# Altium schematic sheet USB_C_PD.SchDoc
size A4; ApprovedBy: Mateusz Kowalik; CheckedBy: Mateusz Kowalik; Author: Mateusz Kowalik; CompanyName: InMotion Labs sp. z o.o.; DrawnBy: Mateusz Kowalik; Engineer: Mateusz Kowalik; Organization: InMotion Labs sp. z o.o.; Address1: Rydlówka 5A; Address2: 30-363 Kraków; Address4: Poland; DocumentNumber: 17; Revision: Rev 0; SheetNumber: 17; SheetTotal: 17
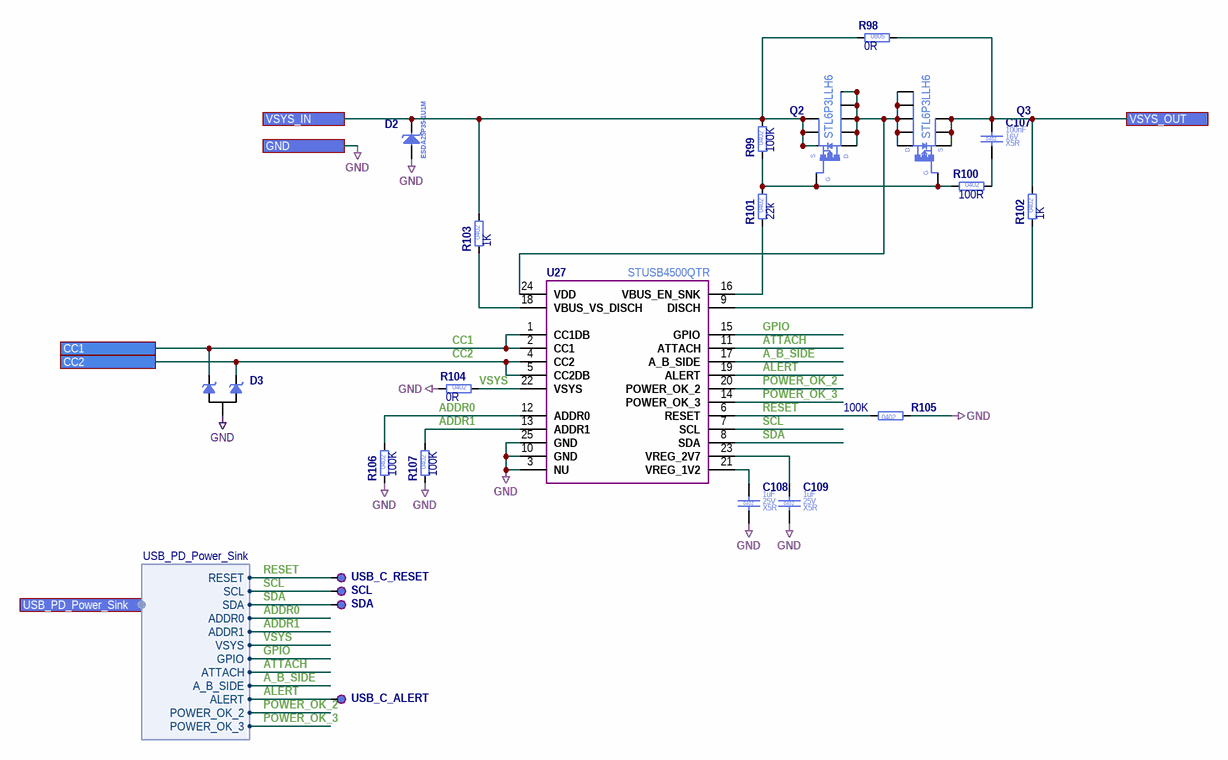
[diagram p0: USB_C_PD.SchDoc]

## Parts
C107  Case/Package: 0402  Voltage Rating (DC): 16V  Dielectric: X5R  Capacitance: 100nF  [C_0402_1005]  (hidden comment: C_100NF_16V_X5R_0402_10)
C108  Case/Package: 0402  Voltage Rating (DC): 25V  Dielectric: X5R  Capacitance: 1uF  [C_0402_1005]  (hidden comment: C_1UF_25V_X5R_0402_10)
C109  Case/Package: 0402  Voltage Rating (DC): 25V  Dielectric: X5R  Capacitance: 1uF  [C_0402_1005]  (hidden comment: C_1UF_25V_X5R_0402_10)
D2  ESDA25P35-1U1M  [TVS_0603_1610]
D3  ESDA25W  [SOT323_SC70]  (value not drawn)
Q2  STL6P3LLH6  [PQFN65P330X332X105_HS-9N]
Q3  STL6P3LLH6  [PQFN65P330X332X105_HS-9N]
R98  Resistance: 0R  Case/Package: 0805  [R_0805_2012]  (hidden comment: R_0R_0805_1)
R99  Resistance: 100K  Case/Package: 0402  [R_0402_1005]  (hidden comment: R_100K_0402_1)
R100  Resistance: 100R  Case/Package: 0402  [R_0402_1005]  (hidden comment: R_100R_0402_1)
R101  Resistance: 22k  Case/Package: 0402  [R_0402_1005]  (hidden comment: R_22K_0402_1)
R102  Resistance: 1K  Case/Package: 0402  [R_0402_1005]  (hidden comment: R_1K_0402_1)
R103  Resistance: 1K  Case/Package: 0402  [R_0402_1005]  (hidden comment: R_1K_0402_1)
R104  Resistance: 0R  Case/Package: 0402  [R_0402_1005]  (hidden comment: R_0R_0402_1)
R105  Resistance: 100K  Case/Package: 0402  [R_0402_1005]  (hidden comment: R_100K_0402_1)
R106  Resistance: 100K  Case/Package: 0402  [R_0402_1005]  (hidden comment: R_100K_0402_1)
R107  Resistance: 100K  Case/Package: 0402  [R_0402_1005]  (hidden comment: R_100K_0402_1)
SCL  TP_PAD_1.3MM  [TP_PAD_1.3MM]  (value not drawn)  (no BOM)
SDA  TP_PAD_1.3MM  [TP_PAD_1.3MM]  (value not drawn)  (no BOM)
U27  STUSB4500QTR  [QFN50P400X400X100_HS-25N]
USB_C_ALERT  TP_PAD_1.3MM  [TP_PAD_1.3MM]  (value not drawn)  (no BOM)
USB_C_RESET  TP_PAD_1.3MM  [TP_PAD_1.3MM]  (value not drawn)  (no BOM)

## Ports
CC1, CC2, GND, USB_PD_Power_Sink (harness USB_PD_Power_Sink), VSYS_IN, VSYS_OUT

## Harnesses
USB_PD_Power_Sink: RESET, SCL, SDA, ADDR0, ADDR1, VSYS, GPIO, ATTACH, A_B_SIDE, ALERT, POWER_OK_2, POWER_OK_3

## Nets
GND: C108.2 C109.2 D2.2(A) D3.3 R104.1 R105.1 R106.1 R107.1 U27.3(NU) U27.10(GND) U27.25(GND) ; port GND
A_B_SIDE: U27.17(A_B_SIDE) ; port USB_PD_Power_Sink.A_B_SIDE
ADDR0: R106.2 U27.12(ADDR0) ; port USB_PD_Power_Sink.ADDR0
ADDR1: R107.2 U27.13(ADDR1) ; port USB_PD_Power_Sink.ADDR1
ALERT: U27.19(ALERT) USB_C_ALERT.1(TP) ; port USB_PD_Power_Sink.ALERT
ATTACH: U27.11(ATTACH) ; port USB_PD_Power_Sink.ATTACH
CC1: D3.1 U27.1(CC1DB) U27.2(CC1) ; port CC1
CC2: D3.2 U27.4(CC2) U27.5(CC2DB) ; port CC2
GPIO: U27.15(GPIO) ; port USB_PD_Power_Sink.GPIO
POWER_OK_2: U27.20(POWER_OK_2) ; port USB_PD_Power_Sink.POWER_OK_2
POWER_OK_3: U27.14(POWER_OK_3) ; port USB_PD_Power_Sink.POWER_OK_3
RESET: R105.2 U27.6(RESET) USB_C_RESET.1(TP) ; port USB_PD_Power_Sink.RESET
SCL: SCL.1(TP) U27.7(SCL) ; port USB_PD_Power_Sink.SCL
SDA: SDA.1(TP) U27.8(SDA) ; port USB_PD_Power_Sink.SDA
VSYS: R104.2 U27.22(VSYS) ; port USB_PD_Power_Sink.VSYS
VSYS_IN: D2.1(C) Q2.1(S) Q2.2(S) Q2.3(S) R98.1 R99.2 R103.2 ; port VSYS_IN
VSYS_OUT: C107.1 Q3.1(S) Q3.2(S) Q3.3(S) R98.2 R102.2 ; port VSYS_OUT
NetC107_2: C107.2 R100.2
NetC108_1: C108.1 U27.21(VREG_1V2)
NetC109_1: C109.1 U27.23(VREG_2V7)
NetQ2_4: Q2.4(G) Q3.4(G) R99.1 R100.1 R101.2
NetQ2_5: Q2.5(D) Q2.6(D) Q2.7(D) Q2.8(D) Q2.9(D) Q3.5(D) Q3.6(D) Q3.7(D) Q3.8(D) Q3.9(D) U27.24(VDD)
NetR101_1: R101.1 U27.16(VBUS_EN_SNK)
NetR102_1: R102.1 U27.9(DISCH)
NetR103_1: R103.1 U27.18(VBUS_VS_DISCH)

## Notes on the sheet
- Title
- Size:
- Date:
- A4

## Library data of the parts
C107 = C_100NF_16V_X5R_0402_10: Ceramic Capacitor; Manufacturer Part Number: EMK105BJ104KV-F; Manufacturer: Taiyo Yuden; Value: 100nF; Tolerance: 10%; Part Number: C_100NF_16V_X5R_0402_10; Mount: Surface Mount; Height: 500um; HelpURL: http://datasheet.octopart.com/EMK105BJ104KV-F-Taiyo-Yuden-datasheet-8857305.pdf; RoHS: Compliant; Max Operating Temperature: 125°C; Status: MK; Supplier 1: Mouser; Supplier Part Number 1: 963-EMK105BJ104KV-F; Manufacturer 2: Samsung Electro-Mechanics; Manufacturer Part Number 2: CL05B104KO5NNNC; Supplier 2: LCSC; Supplier Part Number 2: C1525
C108 C109 = C_1UF_25V_X5R_0402_10: Ceramic Capacitor; Manufacturer Part Number: CL05A105KA5NQNC; Manufacturer: Samsung Electro-Mechanics; Value: 1uF; Tolerance: 10%; Part Number: C_1UF_25V_X5R_0402_10; Mount: Surface Mount; Height: 550um; HelpURL: https://pl.mouser.com/datasheet/2/585/MLCC-1837944.pdf; RoHS: Compliant; Max Operating Temperature: 85°C; Status: MK; Supplier 1: Mouser; Supplier Part Number 1: 187-CL05A105KA5NQNC; Manufacturer 2: Samsung Electro-Mechanics; Manufacturer Part Number 2: CL05A105KA5NQNC; Supplier 2: LCSC; Supplier Part Number 2: C52923
D2 = ESDA25P35-1U1M: High power transient voltage suppressor; Manufacturer: STMicroelectronics; Max Power Dissipation: 1400W; Direction: Unidirectional; Max Breakdown Voltage: 24.6; Working Voltage: 22V; Min Breakdown Voltage: 23.3V; Box: 391; Part Number: ESDA25P35-1U1M; Case/Package: 0603; Manufacturer Part Number: ESDA25P35-1U1M; Mount: Surface Mount; HelpURL: https://pl.mouser.com/datasheet/2/389/esda25p35_1u1m-1848969.pdf; Max Operating Temperature: 150°C; RoHS: Compliant; Status: MK; Supplier 1: Mouser; Supplier Part Number 1: 511-ESDA25P35-1U1M; Height: 600um; Stock: 20
D3 = ESDA25W: TVS DIODE 24VWM SOT23; Manufacturer: STMicroelectronics; Capacitance: 65pF; Max Power Dissipation: 400W; Direction: Unidirectional; Max Breakdown Voltage: 30V; Working Voltage: 24V; Min Breakdown Voltage: 25V; Box: 395; Part Number: ESDA25W; Case/Package: SOT-23; Manufacturer Part Number: ESDA25W; Mount: Surface Mount; HelpURL: https://pl.mouser.com/datasheet/2/389/esdaxxxwx-1849182.pdf; Max Operating Temperature: 125°C; Height: 1.4mm; Status: MK; Supplier 1: Mouser; Supplier Part Number 1: 511-ESDA25W; Stock: 5
Q2 Q3 = STL6P3LLH6: P-MOSFET 30V 6A 24mOhm; Manufacturer: STMicroelectronics; Max Power Dissipation: 2.9W; Drain to Source Resistance: 24mR; Polarization: PMOS; Threshold Voltage: 1V; Box: 399; Part Number: STL6P3LLH6; Manufacturer Part Number: STL6P3LLH6; Case/Package: PQFN; Continuous Drain Current: 6A; Drain to Source Voltage: 30V; Mount: Surface Mount; HelpURL: https://pl.mouser.com/datasheet/2/389/stl6p3llh6-1851075.pdf; Max Operating Temperature: 150°C; Status: MK; RoHS: Compliant; Supplier 1: Mouser; Supplier Part Number 1: 511-STL6P3LLH6; Stock: 15
R98 = R_0R_0805_1: Thick Film Resistor; Manufacturer: Yageo; Manufacturer Part Number: RC0805JR-070RL; Value: 0R; Tolerance: 5%; Voltage Rating (DC): 150V; Power Rating: 125mW; Stats: MK; Part Number: R_0R_0805_1; Mount: Surface Mount; Height: 500um; HelpURL: https://pl.mouser.com/datasheet/2/447/PYu-RC_Group_51_RoHS_L_10-1527934.pdf; RoHS: Compliant; Max Operating Temperature: 155°C; Supplier 1: Mouser; Supplier Part Number 1: 603-RC0805JR-070RL; Manufacturer 2: Uniroyal Elec; Manufacturer Part Number 2: 0805W8F0000T5E; Supplier 2: LCSC; Supplier Part Number 2: C17477
R99 R105-R107 = R_100K_0402_1: Thick Film Resistor; Manufacturer: Yageo; Manufacturer Part Number: RC0402FR-07100KL; Value: 100K; Tolerance: 1%; Voltage Rating (DC): 50V; Power Rating: 63mW; Stats: MK; Part Number: R_100K_0402_1; Mount: Surface Mount; Height: 350um; HelpURL: http://datasheet.octopart.com/RC0402FR-07100KL-Yageo-datasheet-127823281.pdf; RoHS: Compliant; Max Operating Temperature: 155°C; Supplier 1: Mouser; Supplier Part Number 1: 603-RC0402FR-07100KL; Manufacturer 2: Uniroyal Elec; Manufacturer Part Number 2: 0402WGF1003TCE; Supplier 2: LCSC; Supplier Part Number 2: C25741
R100 = R_100R_0402_1: Thick Film Resistor; Manufacturer: Yageo; Manufacturer Part Number: RC0402FR-13100RL; Value: 100R; Tolerance: 1%; Voltage Rating (DC): 50V; Power Rating: 63mW; Part Number: R_100R_0402_1; Mount: Surface Mount; Height: 350um; HelpURL: https://pl.mouser.com/datasheet/2/447/PYu-RC_Group_51_RoHS_L_10-1527934.pdf; Max Operating Temperature: 155°C; Supplier 1: Mouser; Supplier Part Number 1: 603-RC0402FR-13100RL; Manufacturer 2: Uniroyal Elec; Manufacturer Part Number 2: 0402WGF1000TCE; RoHS: Compliant; Supplier 2: LCSC; Supplier Part Number 2: C25076
R101 = R_22K_0402_1: Thick Film resistor; Manufacturer: Yageo; Manufacturer Part Number: RC0402FR-0722KL; Value: 22k; Tolerance: 1%; Voltage Rating (DC): 50V; Power Rating: 63mW; Stats: MK; Part Number: R_22K_0402_1; Mount: Surface Mount; Height: 350um; HelpURL: http://datasheet.octopart.com/RC0402FR-0722KL-Yageo-datasheet-137700087.pdf; RoHS: Compliant; Max Operating Temperature: 155°C; Supplier 1: Mouser; Supplier Part Number 1: 603-RC0402FR-0722KL; Manufacturer 2: Uniroyal Elec; Manufacturer Part Number 2: 0402WGF2202TCE; Supplier 2: LCSC; Supplier Part Number 2: C25768
R102 R103 = R_1K_0402_1: Thick Film Resistor; Manufacturer: Yageo; Manufacturer Part Number: RC0402FR-7D1KL; Value: 1K; Tolerance: 1%; Voltage Rating (DC): 50V; Power Rating: 63mW; Stats: MK; Part Number: R_1K_0402_1; Mount: Surface Mount; Height: 350um; HelpURL: https://pl.mouser.com/datasheet/2/447/PYu-RC_Group_51_RoHS_L_10-1664068.pdf; RoHS: Compliant; Max Operating Temperature: 155°C; Supplier 1: Mouser; Supplier Part Number 1: 603-RC0402FR-7D1KL; Manufacturer 2: Uniroyal Elec; Manufacturer Part Number 2: 0402WGF1001TCE; Supplier 2: LCSC; Supplier Part Number 2: C11702
R104 = R_0R_0402_1: Thick Film Resistor; Manufacturer: Yageo; Manufacturer Part Number: RC0402FR-070RL; Value: 0R; Tolerance: 1%; Voltage Rating (DC): 50V; Power Rating: 63mW; Stats: MK; Part Number: R_0R_0402_1; Mount: Surface Mount; Height: 350um; HelpURL: http://datasheet.octopart.com/2176049-1-TE-Connectivity---AMP-datasheet-11120217.pdf; RoHS: Compliant; Max Operating Temperature: 155°C; Supplier 1: Mouser; Supplier Part Number 1: 603-RC0402FR-070RL; Manufacturer 2: Uniroyal Elec; Manufacturer Part Number 2: 0402WGF0000TCE; Supplier 2: LCSC; Supplier Part Number 2: C17168
SCL SDA USB_C_ALERT USB_C_RESET = TP_PAD_1.3MM: Testpoint SMD 1.3mm; Part Number: TP_PAD_1.3MM; Case/Package: SMD; Length: 0mm
U27 = STUSB4500QTR: Standalone USB PD controller for power sinking devices; Manufacturer: STMicroelectronics; Box: 92; Manufacturer Part Number: STUSB4500QTR; Part Number: STUSB4500QTR; Case/Package: QFN; Mount: Surface Mount; Height: 900um; HelpURL: https://www.st.com/resource/en/datasheet/stusb4500.pdf; Lead Free: Lead Free; Max Operating Temperature: 105°C; Min Operating Temperature: -40°C; Number of Pins: 24; RoHS: Compliant; Status: MK; Supplier 1: Mouser; Supplier Part Number 1: 511-STUSB4500QTR; Stock: 5